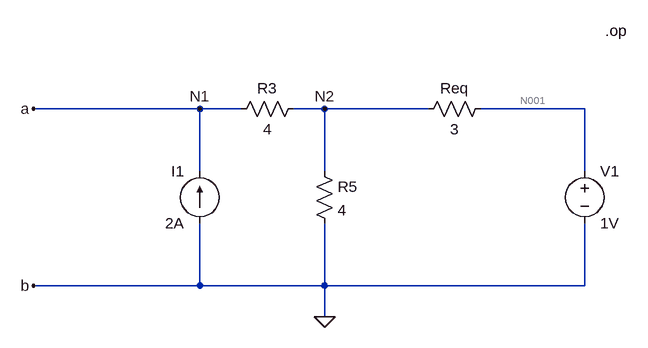
[diagram p0: schematic simplifié.asc]
simplifié.asc, the LTspice schematic file:
Version 4
SHEET 1 880 680
WIRE 64 32 -192 32
WIRE 128 32 64 32
WIRE 256 32 208 32
WIRE 416 32 256 32
WIRE 656 32 496 32
WIRE 64 128 64 32
WIRE 256 128 256 32
WIRE 656 128 656 32
WIRE 64 304 64 208
WIRE 64 304 -192 304
WIRE 256 304 256 208
WIRE 256 304 64 304
WIRE 656 304 656 208
WIRE 656 304 256 304
WIRE 256 352 256 304
FLAG -192 32 a
FLAG -192 304 b
FLAG 256 352 0
FLAG 64 32 N1
FLAG 256 32 N2
SYMBOL voltage 656 112 R0
WINDOW 123 0 0 Left 0
WINDOW 39 0 0 Left 0
SYMATTR InstName V1
SYMATTR Value 1V
SYMBOL current 64 208 R180
WINDOW 0 24 80 Left 2
WINDOW 3 24 0 Left 2
SYMATTR InstName I1
SYMATTR Value 2A
SYMBOL res 512 16 R90
WINDOW 0 0 56 VBottom 2
WINDOW 3 32 56 VTop 2
SYMATTR InstName Req
SYMATTR Value 3
SYMBOL res 224 16 R90
WINDOW 0 0 56 VBottom 2
WINDOW 3 32 56 VTop 2
SYMATTR InstName R3
SYMATTR Value 4
SYMBOL res 240 112 R0
SYMATTR InstName R5
SYMATTR Value 4
TEXT 688 -88 Left 2 !.op

The netlist it stands for:
* simplifié.asc
V1 N001 0 1V
I1 0 N1 2A
Req N001 N2 3
R3 N2 N1 4
R5 N2 0 4
.op
.backanno
.end

* Results of the author's LTspice run, read from the files saved beside the schematic
* Operating Point:
*   V(n001) = 1 V
*   V(n1) = 12 V
*   V(n2) = 4 V
*   I(I1) = 2 A
*   I(R5) = 1 A
*   I(R3) = -2 A
*   I(Req) = -1 A
*   I(V1) = 1 A